# Altium schematic sheet micro_controller.schdoc
size 148 x 110 mm
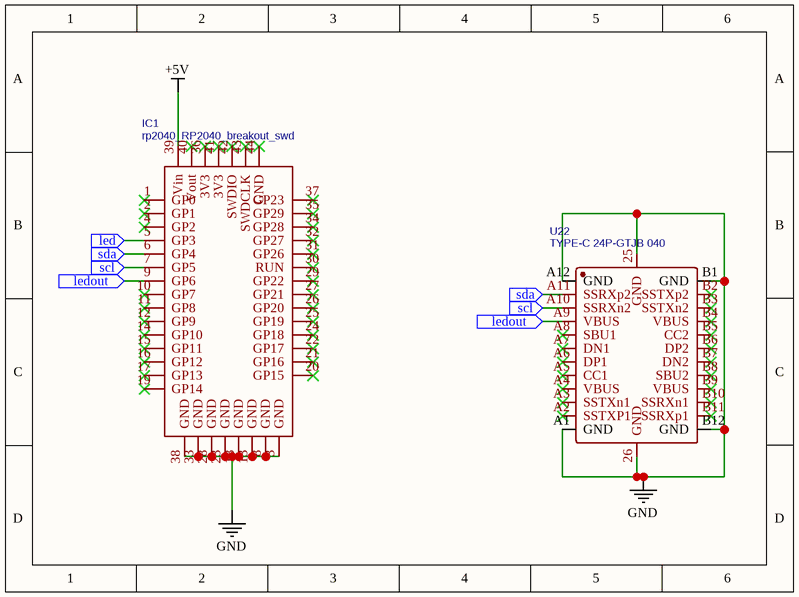
[diagram p0: micro_controller.schdoc]

## Parts
IC1  rp2040_RP2040_breakout_swd  [RP2040:RP2040-BREAKOUT_SWD]
U22  TYPE-C 24P-GTJB 040  [USB-C-SMD_TYPE-C-24P-GTJB-040]

## Ports
led (in), ledout (in), scl (in), sda (in)

## Nets
+5V: IC1.39(Vin)
GND: IC1.3(GND) IC1.8(GND) IC1.13(GND) IC1.18(GND) IC1.23(GND) IC1.28(GND) IC1.33(GND) IC1.38(GND) U22.25(GND) U22.26(GND) U22.A1(GND) U22.A12(GND) U22.B1(GND) U22.B12(GND)
led: IC1.5(GP3) ; port led
ledout: IC1.9(GP6) U22.A9(VBUS) ; port ledout
scl: IC1.7(GP5) U22.A10(SSRXn2) ; port scl
sda: IC1.6(GP4) U22.A11(SSRXp2) ; port sda

Not connected (* = marked no-connect by the designer): IC1 1(GP0)* 2(GP1)* 4(GP2)* 10(GP7)* 11(GP8)* 12(GP9)* 14(GP10)* 15(GP11)* 16(GP12)* 17(GP13)* 19(GP14)* 20(GP15)* 21(GP16)* 22(GP17)* 24(GP18)* 25(GP19)* 26(GP20)* 27(GP21)* 29(GP22)* 30(RUN)* 31(GP26)* 32(GP27)* 34(GP28)* 35(GP29)* 36(3V3)* 37(GP23)* 40(Vout)* 41(3V3)* 42(SWDIO)* 43(SWDCLK)* 44(GND)*; U22 A2(SSTXP1)* A3(SSTXn1)* A4(VBUS)* A5(CC1)* A6(DP1)* A7(DN1)* A8(SBU1)* B2(SSTXp2)* B3(SSTXn2)* B4(VBUS)* B5(CC2)* B6(DP2)* B7(DN2)* B8(SBU2)* B9(VBUS)* B10(SSRXn1)* B11(SSRXp1)*

## Library data of the parts
IC1 = rp2040_RP2040_breakout_swd: Add into BOM: yes; Origin Footprint: RP2040-Breakout_swd; Contributor: rataweb; Symbol: rp2040_RP2040_breakout_swd; Device: rp2040_RP2040_breakout_swd; Convert to PCB: yes; spicePre: I; spiceSymbolName: rp2040_RP2040_breakout_swd
U22 = TYPE-C 24P-GTJB 040: Manufacturer: SHOU HAN(首韩); Contributor: lcsc; Supplier: LCSC; Supplier Part: C3151751; Manufacturer Part: TYPE-C 24P-GTJB 040; JLCPCB Part Class: Extended Part; spicePre: U; spiceSymbolName: TYPE-C 24P-GTJB 040